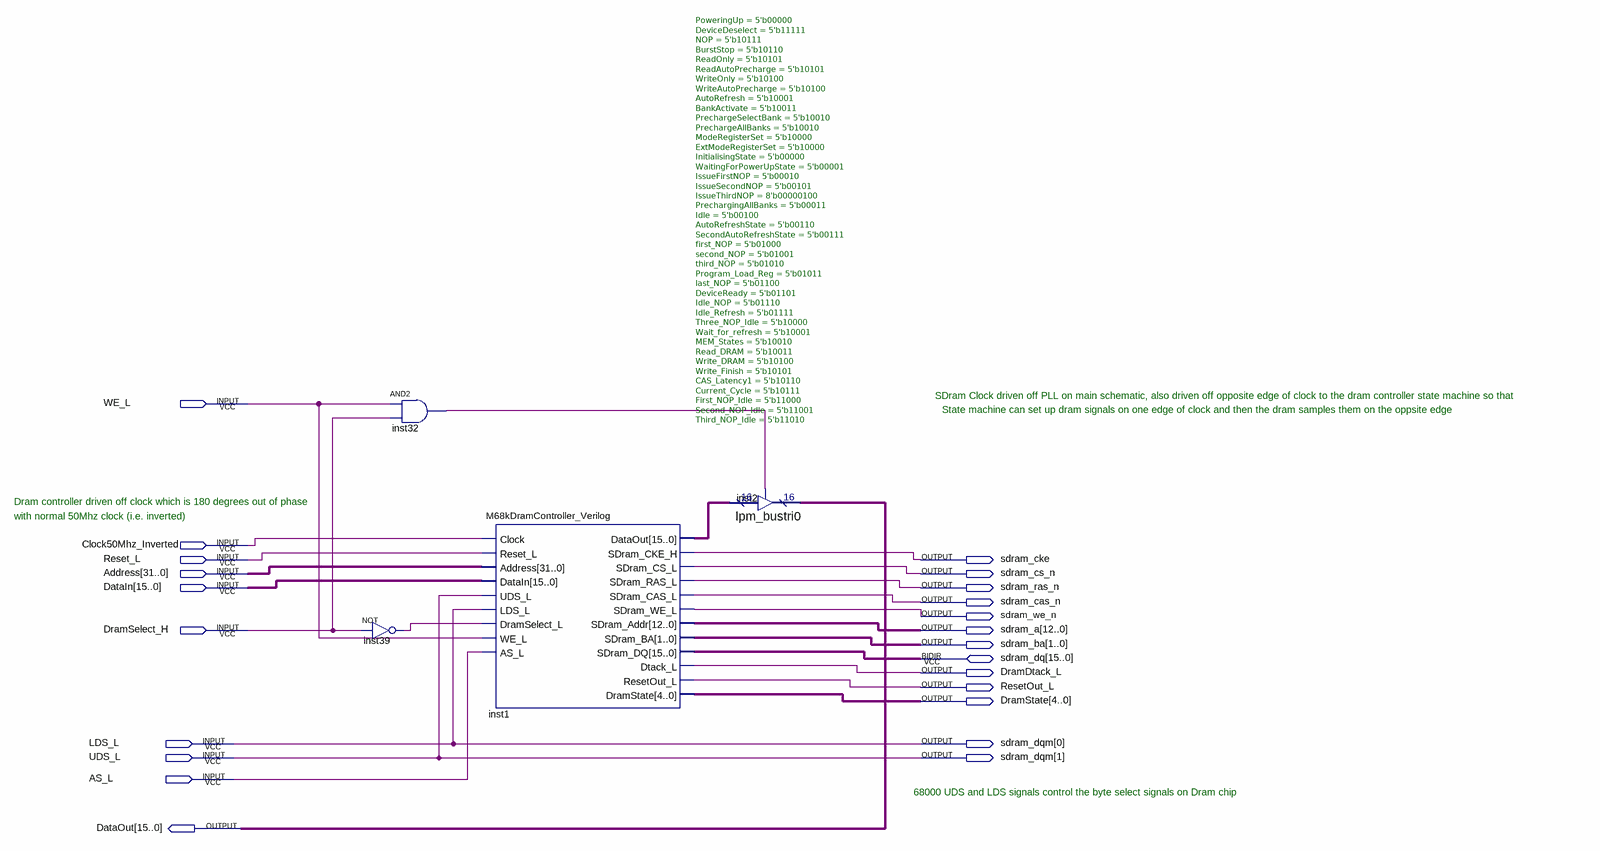
[diagram p0: schematic sheet]
// Quartus schematic Dram.bdf as structural Verilog: 4 symbols, 23 pins
module Dram (
  input  WE_L,
  input  Clock50Mhz_Inverted,
  input  Reset_L,
  input  [31:0] Address,
  input  [15:0] DataIn,
  input  DramSelect_H,
  input  LDS_L,
  input  UDS_L,
  input  AS_L,
  inout  [15:0] sdram_dq,
  output sdram_cke,
  output sdram_cs_n,
  output sdram_ras_n,
  output sdram_cas_n,
  output sdram_we_n,
  output [12:0] sdram_a,
  output [1:0] sdram_ba,
  output DramDtack_L,
  output ResetOut_L,
  output [4:0] DramState,
  output [1:0] sdram_dqm,
  output [15:0] DataOut
);

  wire inst32_out, inst39_out;
  wire [15:0] inst1_dataout;

  not inst39 (inst39_out, DramSelect_H);
  and inst32 (inst32_out, WE_L, DramSelect_H);
  M68kDramController_Verilog #(.PoweringUp(5'b00000), .DeviceDeselect(5'b11111), .NOP(5'b10111), .BurstStop(5'b10110), .ReadOnly(5'b10101), .ReadAutoPrecharge(5'b10101), .WriteOnly(5'b10100), .WriteAutoPrecharge(5'b10100), .AutoRefresh(5'b10001), .BankActivate(5'b10011), .PrechargeSelectBank(5'b10010), .PrechargeAllBanks(5'b10010), .ModeRegisterSet(5'b10000), .ExtModeRegisterSet(5'b10000), .InitialisingState(5'b00000), .WaitingForPowerUpState(5'b00001), .IssueFirstNOP(5'b00010), .IssueSecondNOP(5'b00101), .IssueThirdNOP(8'b00000100), .PrechargingAllBanks(5'b00011), .Idle(5'b00100), .AutoRefreshState(5'b00110), .SecondAutoRefreshState(5'b00111), .first_NOP(5'b01000), .second_NOP(5'b01001), .third_NOP(5'b01010), .Program_Load_Reg(5'b01011), .last_NOP(5'b01100), .DeviceReady(5'b01101), .Idle_NOP(5'b01110), .Idle_Refresh(5'b01111), .Three_NOP_Idle(5'b10000), .Wait_for_refresh(5'b10001), .MEM_States(5'b10010), .Read_DRAM(5'b10011), .Write_DRAM(5'b10100), .Write_Finish(5'b10101), .CAS_Latency1(5'b10110), .Current_Cycle(5'b10111), .First_NOP_Idle(5'b11000), .Second_NOP_Idle(5'b11001), .Third_NOP_Idle(5'b11010)) inst1 (
    .Clock(Clock50Mhz_Inverted), .Reset_L(Reset_L), .Address(Address), .DataIn(DataIn), .UDS_L(UDS_L),
    .LDS_L(LDS_L), .DramSelect_L(inst39_out), .WE_L(WE_L), .AS_L(AS_L), .DataOut(inst1_dataout),
    .SDram_CKE_H(sdram_cke), .SDram_CS_L(sdram_cs_n), .SDram_RAS_L(sdram_ras_n), .SDram_CAS_L(sdram_cas_n),
    .SDram_WE_L(sdram_we_n), .SDram_Addr(sdram_a), .SDram_BA(sdram_ba), .Dtack_L(DramDtack_L),
    .ResetOut_L(ResetOut_L), .DramState(DramState), .SDram_DQ(sdram_dq));
  lpm_bustri0 inst2 (.enabledt(inst32_out), .data(inst1_dataout), .tridata(DataOut));

  assign sdram_dqm = {UDS_L, LDS_L};

  // Notes on the sheet:
  //   SDram Clock driven off PLL on main schematic, also driven off opposite edge of clock to the dram controller state machine so that
  //   State machine can set up dram signals on one edge of clock and then the dram samples them on the oppsite edge
  //   Dram controller driven off clock which is 180 degrees out of phase
  //   with normal 50Mhz clock (i.e. inverted)
  //   68000 UDS and LDS signals control the byte select signals on Dram chip
endmodule
